# EAGLE schematic wiring (EAGLE 9.5.2)
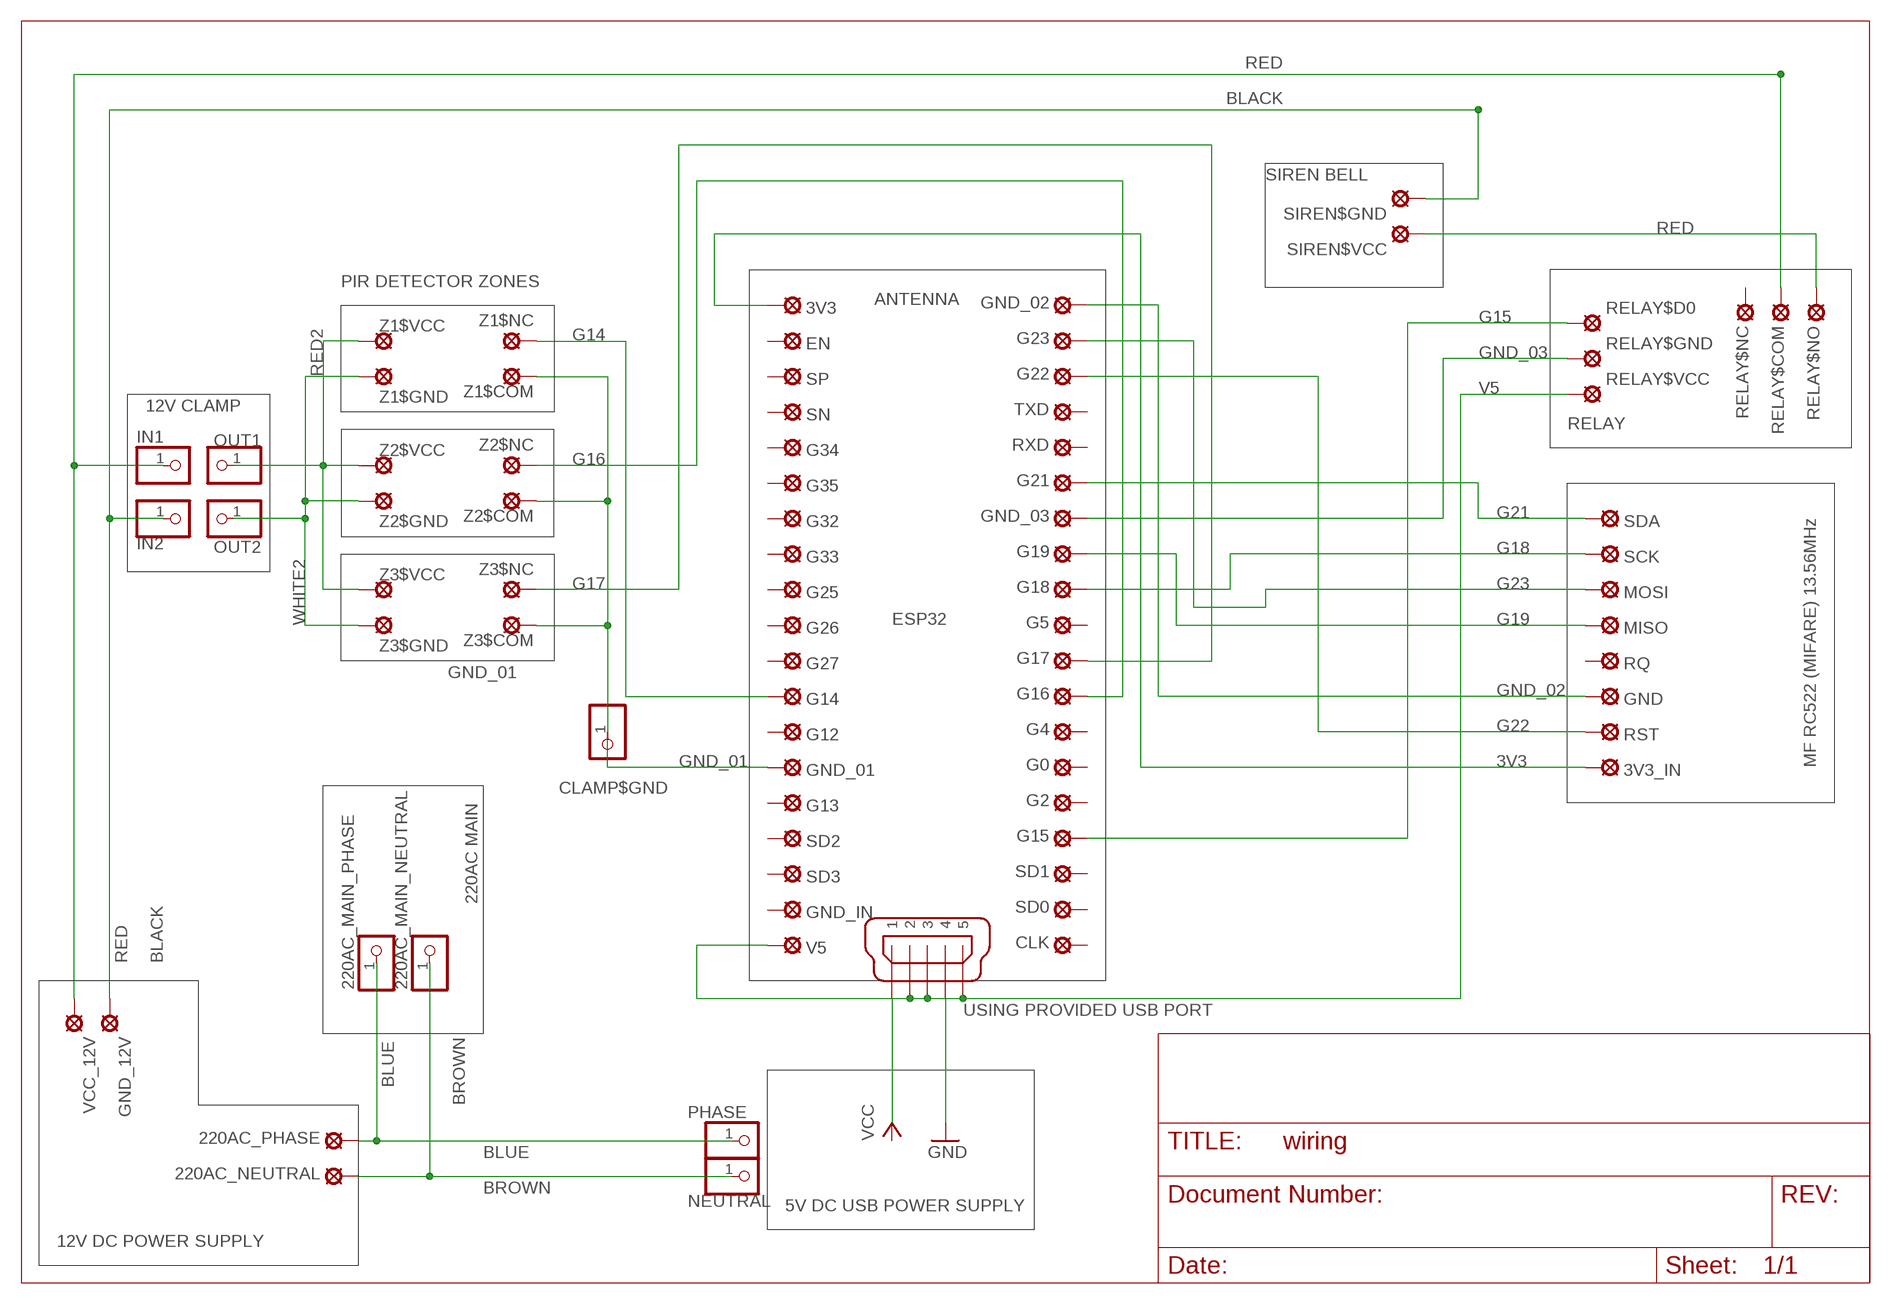
[diagram p0: schematic, sheet 1]

## Parts
3V3  MCS08  [MCS08]
3V3_IN  MCS08  [MCS08]
220AC_MAIN_NEUTRAL  PINHD-1X1  [1X01]
220AC_MAIN_PHASE  PINHD-1X1  [1X01]
220AC_NEUTRAL  MCS08  [MCS08]
220AC_PHASE  MCS08  [MCS08]
CLAMP$GND  PINHD-1X1  [1X01]
CLK  MCS08  [MCS08]
EN  MCS08  [MCS08]
G0  MCS08  [MCS08]
G2  MCS08  [MCS08]
G4  MCS08  [MCS08]
G5  MCS08  [MCS08]
G12  MCS08  [MCS08]
G13  MCS08  [MCS08]
G14  MCS08  [MCS08]
G15  MCS08  [MCS08]
G16  MCS08  [MCS08]
G17  MCS08  [MCS08]
G18  MCS08  [MCS08]
G19  MCS08  [MCS08]
G21  MCS08  [MCS08]
G22  MCS08  [MCS08]
G23  MCS08  [MCS08]
G25  MCS08  [MCS08]
G26  MCS08  [MCS08]
G27  MCS08  [MCS08]
G32  MCS08  [MCS08]
G33  MCS08  [MCS08]
G34  MCS08  [MCS08]
G35  MCS08  [MCS08]
GND  MCS08  [MCS08]
GND_01  MCS08  [MCS08]
GND_02  MCS08  [MCS08]
GND_03  MCS08  [MCS08]
GND_12V  MCS08  [MCS08]
GND_IN  MCS08  [MCS08]
IN1  PINHD-1X1  [1X01]
IN2  PINHD-1X1  [1X01]
MISO  MCS08  [MCS08]
MOSI  MCS08  [MCS08]
NEUTRAL  PINHD-1X1  [1X01]
OUT1  PINHD-1X1  [1X01]
OUT2  PINHD-1X1  [1X01]
PHASE  PINHD-1X1  [1X01]
RELAY$COM  MCS08  [MCS08]
RELAY$D0  MCS08  [MCS08]
RELAY$GND  MCS08  [MCS08]
RELAY$NC  MCS08  [MCS08]
RELAY$NO  MCS08  [MCS08]
RELAY$VCC  MCS08  [MCS08]
RQ  MCS08  [MCS08]
RST  MCS08  [MCS08]
RXD  MCS08  [MCS08]
SCK  MCS08  [MCS08]
SD0  MCS08  [MCS08]
SD1  MCS08  [MCS08]
SD2  MCS08  [MCS08]
SD3  MCS08  [MCS08]
SDA  MCS08  [MCS08]
SIREN$GND  MCS08  [MCS08]
SIREN$VCC  MCS08  [MCS08]
SN  MCS08  [MCS08]
SP  MCS08  [MCS08]
TXD  MCS08  [MCS08]
V5  MCS08  [MCS08]
VCC_12V  MCS08  [MCS08]
X1  MINI-USB_SHIELD5P2-32005-601  [32005-601]
Z1$COM  MCS08  [MCS08]
Z1$GND  MCS08  [MCS08]
Z1$NC  MCS08  [MCS08]
Z1$VCC  MCS08  [MCS08]
Z2$COM  MCS08  [MCS08]
Z2$GND  MCS08  [MCS08]
Z2$NC  MCS08  [MCS08]
Z2$VCC  MCS08  [MCS08]
Z3$COM  MCS08  [MCS08]
Z3$GND  MCS08  [MCS08]
Z3$NC  MCS08  [MCS08]
Z3$VCC  MCS08  [MCS08]

## Nets
3V3: 3V3.MP 3V3_IN.MP
BLACK: GND_12V.MP IN2.1 SIREN$GND.MP
BLUE: 220AC_MAIN_PHASE.1 220AC_PHASE.MP PHASE.1
BROWN: 220AC_MAIN_NEUTRAL.1 220AC_NEUTRAL.MP NEUTRAL.1
G14: G14.MP Z1$NC.MP
G15: G15.MP RELAY$D0.MP
G16: G16.MP Z2$NC.MP
G17: G17.MP Z3$NC.MP
G18: G18.MP SCK.MP
G19: G19.MP MISO.MP
G21: G21.MP SDA.MP
G22: G22.MP RST.MP
G23: G23.MP MOSI.MP
GND: X1.4
GND_01: CLAMP$GND.1 GND_01.MP Z1$COM.MP Z2$COM.MP Z3$COM.MP
GND_02: GND.MP GND_02.MP
GND_03: GND_03.MP RELAY$GND.MP
N$2: X1.1
RED: IN1.1 RELAY$COM.MP RELAY$NO.MP SIREN$VCC.MP VCC_12V.MP
RED2: OUT1.1 Z1$VCC.MP Z2$VCC.MP Z3$VCC.MP
V5: RELAY$VCC.MP V5.MP X1.2 X1.3 X1.5
WHITE2: OUT2.1 Z1$GND.MP Z2$GND.MP Z3$GND.MP
Unconnected: CLK.MP EN.MP G0.MP G2.MP G4.MP G5.MP G12.MP G13.MP G25.MP G26.MP G27.MP G32.MP G33.MP G34.MP G35.MP GND_IN.MP RELAY$NC.MP RQ.MP RXD.MP SD0.MP SD1.MP SD2.MP SD3.MP SN.MP SP.MP TXD.MP X1.M1(S1) X1.M2(S2)

## Notes on the sheet
- SIREN BELL
- PIR DETECTOR ZONES
- ANTENNA
- 12V CLAMP
- RELAY
- ESP32
- MF RC522 (MIFARE) 13.56MHz
- 220AC MAIN
- USING PROVIDED USB PORT
- 5V DC USB POWER SUPPLY
- 12V DC POWER SUPPLY

## Library data of the parts
3V3 3V3_IN 220AC_NEUTRAL 220AC_PHASE CLK EN G0 G2 G4 G5 G12-G19 G21-G23 G25-G27 G32-G35 GND GND_01-GND_03 GND_12V GND_IN MISO MOSI RELAY$COM RELAY$D0 RELAY$GND RELAY$NC RELAY$NO RELAY$VCC RQ RST RXD SCK SD0 SD1-SD3 SDA SIREN$GND SIREN$VCC SN SP TXD V5 VCC_12V Z1$COM Z1$GND Z1$NC Z1$VCC Z2$COM Z2$GND Z2$NC Z2$VCC Z3$COM Z3$GND Z3$NC Z3$VCC = solpad:MCS08: SOLDER PAD MC S0,8, drill 1.2 mm, distributor Buerklin, 08F130
220AC_MAIN_NEUTRAL 220AC_MAIN_PHASE CLAMP$GND IN1 IN2 NEUTRAL OUT1 OUT2 PHASE = pinhead:PINHD-1X1: PIN HEADER
X1 = con-cypressindustries:MINI-USB_SHIELD5P2-: MINI USB-B R/A DIP 5pol. Source: www.cypressindustries.com; OC_FARNELL: unknown; OC_NEWARK: unknown